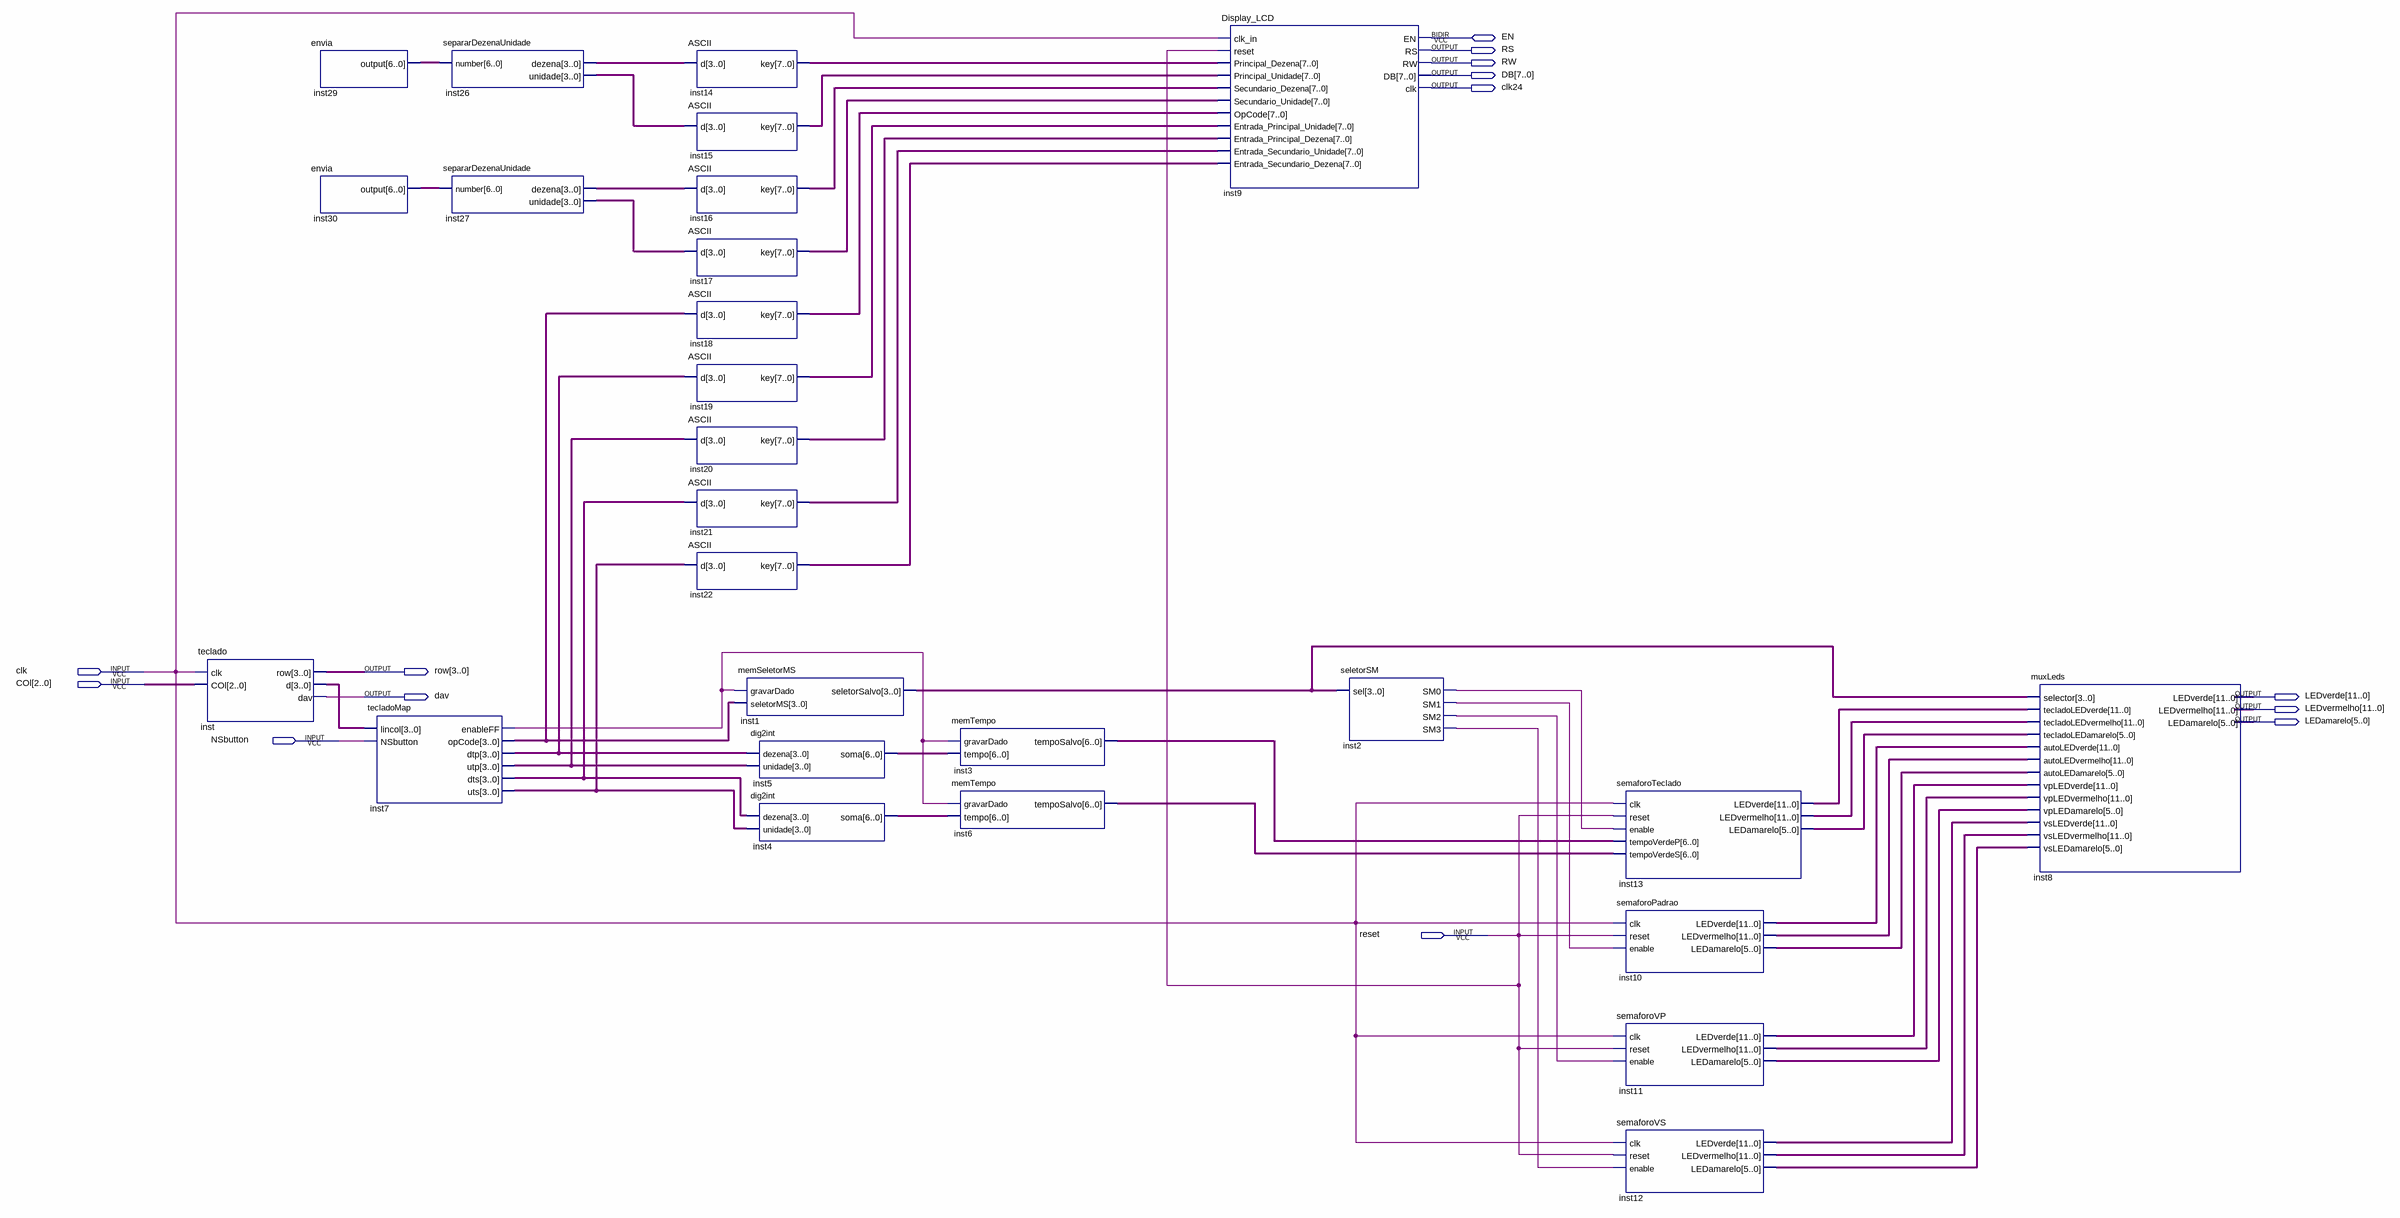
[diagram p0: schematic sheet]
// Quartus schematic Projeto01.bdf as structural Verilog: 27 symbols, 14 pins
module Projeto01 (
  input  clk,
  input  [2:0] COl,
  input  NSbutton,
  input  reset,
  inout  EN,
  output RS,
  output RW,
  output [7:0] DB,
  output clk24,
  output [3:0] row,
  output dav,
  output [11:0] LEDverde,
  output [11:0] LEDvermelho,
  output [5:0] LEDamarelo
);

  wire inst2_sm0, inst2_sm1, inst2_sm2, inst2_sm3, inst7_enableff;
  wire [3:0] inst1_seletorsalvo, inst7_dtp, inst7_dts, inst7_opcode, inst7_utp, inst7_uts, inst26_dezena,
       inst26_unidade, inst27_dezena, inst27_unidade, inst_d;
  wire [5:0] inst10_ledamarelo, inst11_ledamarelo, inst12_ledamarelo, inst13_ledamarelo;
  wire [6:0] inst3_temposalvo, inst4_soma, inst5_soma, inst6_temposalvo, inst29_output, inst30_output;
  wire [7:0] inst14_key, inst15_key, inst16_key, inst17_key, inst18_key, inst19_key, inst20_key, inst21_key,
       inst22_key;
  wire [11:0] inst10_ledverde, inst10_ledvermelho, inst11_ledverde, inst11_ledvermelho, inst12_ledverde,
       inst12_ledvermelho, inst13_ledverde, inst13_ledvermelho;

  teclado inst (.clk(clk), .COl(COl), .row(row), .d(inst_d), .dav(dav));
  envia inst29 (.\output (inst29_output));
  envia inst30 (.\output (inst30_output));
  tecladoMap inst7 (
    .lincol(inst_d), .NSbutton(NSbutton), .enableFF(inst7_enableff), .opCode(inst7_opcode), .dtp(inst7_dtp),
    .utp(inst7_utp), .dts(inst7_dts), .uts(inst7_uts));
  separarDezenaUnidade inst26 (.number(inst29_output), .dezena(inst26_dezena), .unidade(inst26_unidade));
  separarDezenaUnidade inst27 (.number(inst30_output), .dezena(inst27_dezena), .unidade(inst27_unidade));
  ASCII inst14 (.d(inst26_dezena), .key(inst14_key));
  ASCII inst15 (.d(inst26_unidade), .key(inst15_key));
  ASCII inst16 (.d(inst27_dezena), .key(inst16_key));
  ASCII inst17 (.d(inst27_unidade), .key(inst17_key));
  ASCII inst18 (.d(inst7_opcode), .key(inst18_key));
  ASCII inst19 (.d(inst7_dtp), .key(inst19_key));
  ASCII inst20 (.d(inst7_utp), .key(inst20_key));
  ASCII inst21 (.d(inst7_dts), .key(inst21_key));
  ASCII inst22 (.d(inst7_uts), .key(inst22_key));
  memSeletorMS inst1 (.gravarDado(inst7_enableff), .seletorMS(inst7_opcode), .seletorSalvo(inst1_seletorsalvo));
  dig2int inst5 (.dezena(inst7_dtp), .unidade(inst7_utp), .soma(inst5_soma));
  dig2int inst4 (.dezena(inst7_dts), .unidade(inst7_uts), .soma(inst4_soma));
  memTempo inst3 (.gravarDado(inst7_enableff), .tempo(inst5_soma), .tempoSalvo(inst3_temposalvo));
  memTempo inst6 (.gravarDado(inst7_enableff), .tempo(inst4_soma), .tempoSalvo(inst6_temposalvo));
  Display_LCD inst9 (
    .clk_in(clk), .reset(reset), .Principal_Dezena(inst14_key), .Principal_Unidade(inst15_key),
    .Secundario_Dezena(inst16_key), .Secundario_Unidade(inst17_key), .OpCode(inst18_key),
    .Entrada_Principal_Unidade(inst19_key), .Entrada_Principal_Dezena(inst20_key),
    .Entrada_Secundario_Unidade(inst21_key), .Entrada_Secundario_Dezena(inst22_key), .RS(RS), .RW(RW),
    .DB(DB), .clk(clk24), .EN(EN));
  seletorSM inst2 (.sel(inst1_seletorsalvo), .SM0(inst2_sm0), .SM1(inst2_sm1), .SM2(inst2_sm2), .SM3(inst2_sm3));
  semaforoTeclado inst13 (
    .clk(clk), .reset(reset), .enable(inst2_sm0), .tempoVerdeP(inst3_temposalvo),
    .tempoVerdeS(inst6_temposalvo), .LEDverde(inst13_ledverde), .LEDvermelho(inst13_ledvermelho),
    .LEDamarelo(inst13_ledamarelo));
  semaforoPadrao inst10 (
    .clk(clk), .reset(reset), .enable(inst2_sm1), .LEDverde(inst10_ledverde),
    .LEDvermelho(inst10_ledvermelho), .LEDamarelo(inst10_ledamarelo));
  semaforoVP inst11 (
    .clk(clk), .reset(reset), .enable(inst2_sm2), .LEDverde(inst11_ledverde),
    .LEDvermelho(inst11_ledvermelho), .LEDamarelo(inst11_ledamarelo));
  semaforoVS inst12 (
    .clk(clk), .reset(reset), .enable(inst2_sm3), .LEDverde(inst12_ledverde),
    .LEDvermelho(inst12_ledvermelho), .LEDamarelo(inst12_ledamarelo));
  muxLeds inst8 (
    .selector(inst1_seletorsalvo), .tecladoLEDverde(inst13_ledverde),
    .tecladoLEDvermelho(inst13_ledvermelho), .tecladoLEDamarelo(inst13_ledamarelo),
    .autoLEDverde(inst10_ledverde), .autoLEDvermelho(inst10_ledvermelho), .autoLEDamarelo(inst10_ledamarelo),
    .vpLEDverde(inst11_ledverde), .vpLEDvermelho(inst11_ledvermelho), .vpLEDamarelo(inst11_ledamarelo),
    .vsLEDverde(inst12_ledverde), .vsLEDvermelho(inst12_ledvermelho), .vsLEDamarelo(inst12_ledamarelo),
    .LEDverde(LEDverde), .LEDvermelho(LEDvermelho), .LEDamarelo(LEDamarelo));
endmodule
